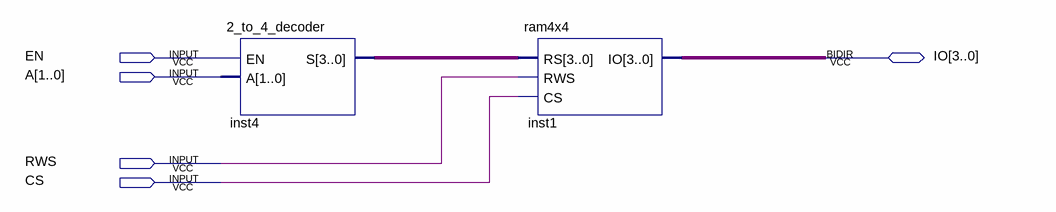
[diagram p0: schematic sheet]
// Quartus schematic ram4x4complete.bdf as structural Verilog: 2 symbols, 5 pins
module ram4x4complete (
  input  EN,
  input  [1:0] A,
  input  RWS,
  input  CS,
  inout  [3:0] IO
);

  wire [3:0] inst4_s;

  \2_to_4_decoder  inst4 (.EN(EN), .A(A), .S(inst4_s));
  ram4x4 inst1 (.RS(inst4_s), .RWS(RWS), .CS(CS), .IO(IO));
endmodule
